# Altium schematic sheet main.SchDoc
size A4
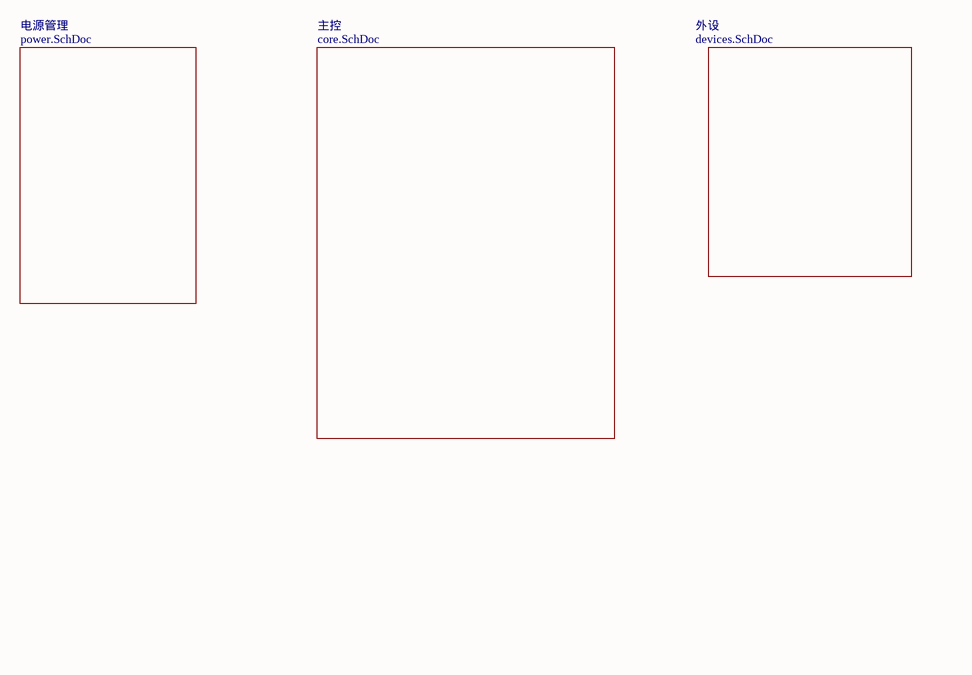
[diagram p0: main.SchDoc]

## Parts
LOGO2  (no value)  [JMU_LOGO(1.35cm)]

## Sub-sheets
主控 = core.SchDoc: no entries
外设 = devices.SchDoc: no entries
电源管理 = power.SchDoc: no entries

## Library data of the parts
LOGO2 = JMU_LOGO: LOGO